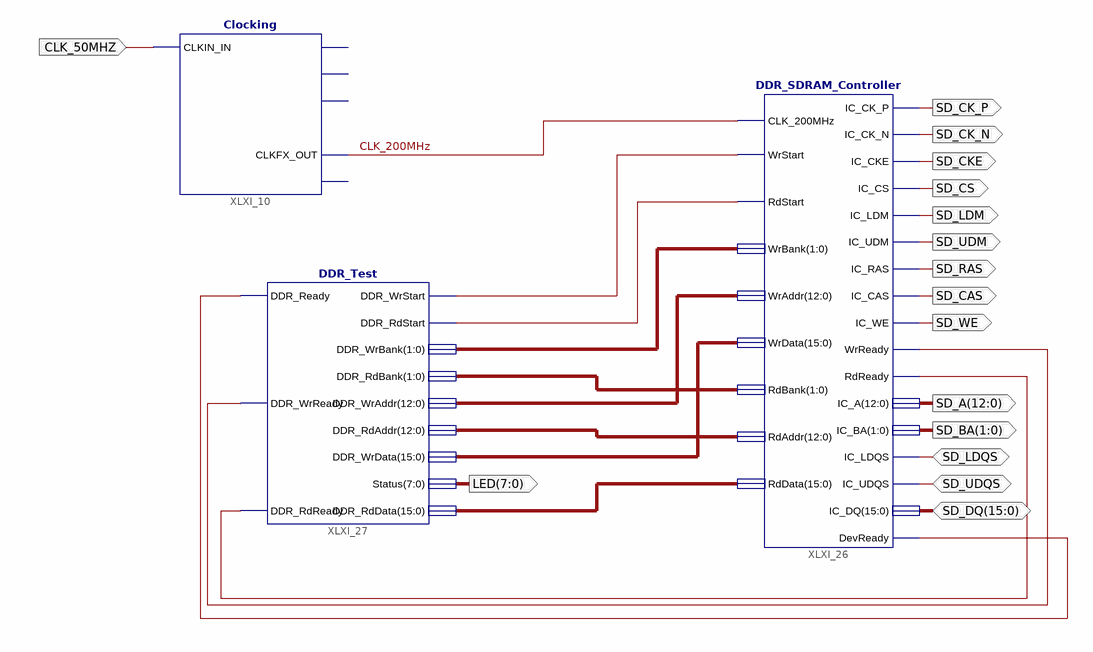
[diagram p0: schematic sheet 1]
// Xilinx ISE schematic Level_Top.sch (spartan3e) as structural Verilog: 3 symbols, 16 ports
module Level_Top (
  input  CLK_50MHZ,
  inout  [15:0] SD_DQ,
  inout  SD_LDQS,
  inout  SD_UDQS,
  output [12:0] SD_A,
  output [1:0] SD_BA,
  output SD_CK_P,
  output SD_CK_N,
  output SD_CKE,
  output SD_CS,
  output SD_LDM,
  output SD_UDM,
  output SD_RAS,
  output SD_CAS,
  output SD_WE,
  output [7:0] LED
);

  wire CLK_200MHz, XLXN_26, XLXN_27, XLXN_36, XLXN_37, XLXN_43;
  wire [1:0] XLXN_28, XLXN_29;
  wire [12:0] XLXN_30, XLXN_31;
  wire [15:0] XLXN_32, XLXN_33;

  Clocking XLXI_10 (
    .CLKIN_IN(CLK_50MHZ), .CLKFX_OUT(CLK_200MHz));  // open: CLKDV_OUT, CLKIN_IBUFG_OUT, CLK0_OUT, CLK2X_OUT
  DDR_SDRAM_Controller XLXI_26 (
    .WrStart(XLXN_26), .RdStart(XLXN_27), .WrBank(XLXN_28), .WrAddr(XLXN_30), .WrData(XLXN_32),
    .RdBank(XLXN_29), .RdAddr(XLXN_31), .RdData(XLXN_33), .IC_LDQS(SD_LDQS), .IC_UDQS(SD_UDQS),
    .IC_DQ(SD_DQ), .IC_CK_P(SD_CK_P), .IC_CK_N(SD_CK_N), .IC_CKE(SD_CKE), .IC_CS(SD_CS), .IC_LDM(SD_LDM),
    .IC_UDM(SD_UDM), .IC_RAS(SD_RAS), .IC_CAS(SD_CAS), .IC_WE(SD_WE), .WrReady(XLXN_37), .RdReady(XLXN_43),
    .DevReady(XLXN_36), .IC_A(SD_A), .IC_BA(SD_BA), .CLK_200MHz(CLK_200MHz));
  DDR_Test XLXI_27 (
    .DDR_Ready(XLXN_36), .DDR_WrReady(XLXN_37), .DDR_RdReady(XLXN_43), .DDR_RdData(XLXN_33),
    .DDR_WrStart(XLXN_26), .DDR_RdStart(XLXN_27), .DDR_WrBank(XLXN_28), .DDR_RdBank(XLXN_29),
    .DDR_WrAddr(XLXN_30), .DDR_RdAddr(XLXN_31), .DDR_WrData(XLXN_32), .Status(LED));
endmodule
